# EAGLE design HexBoard (EAGLE 7.1.0)
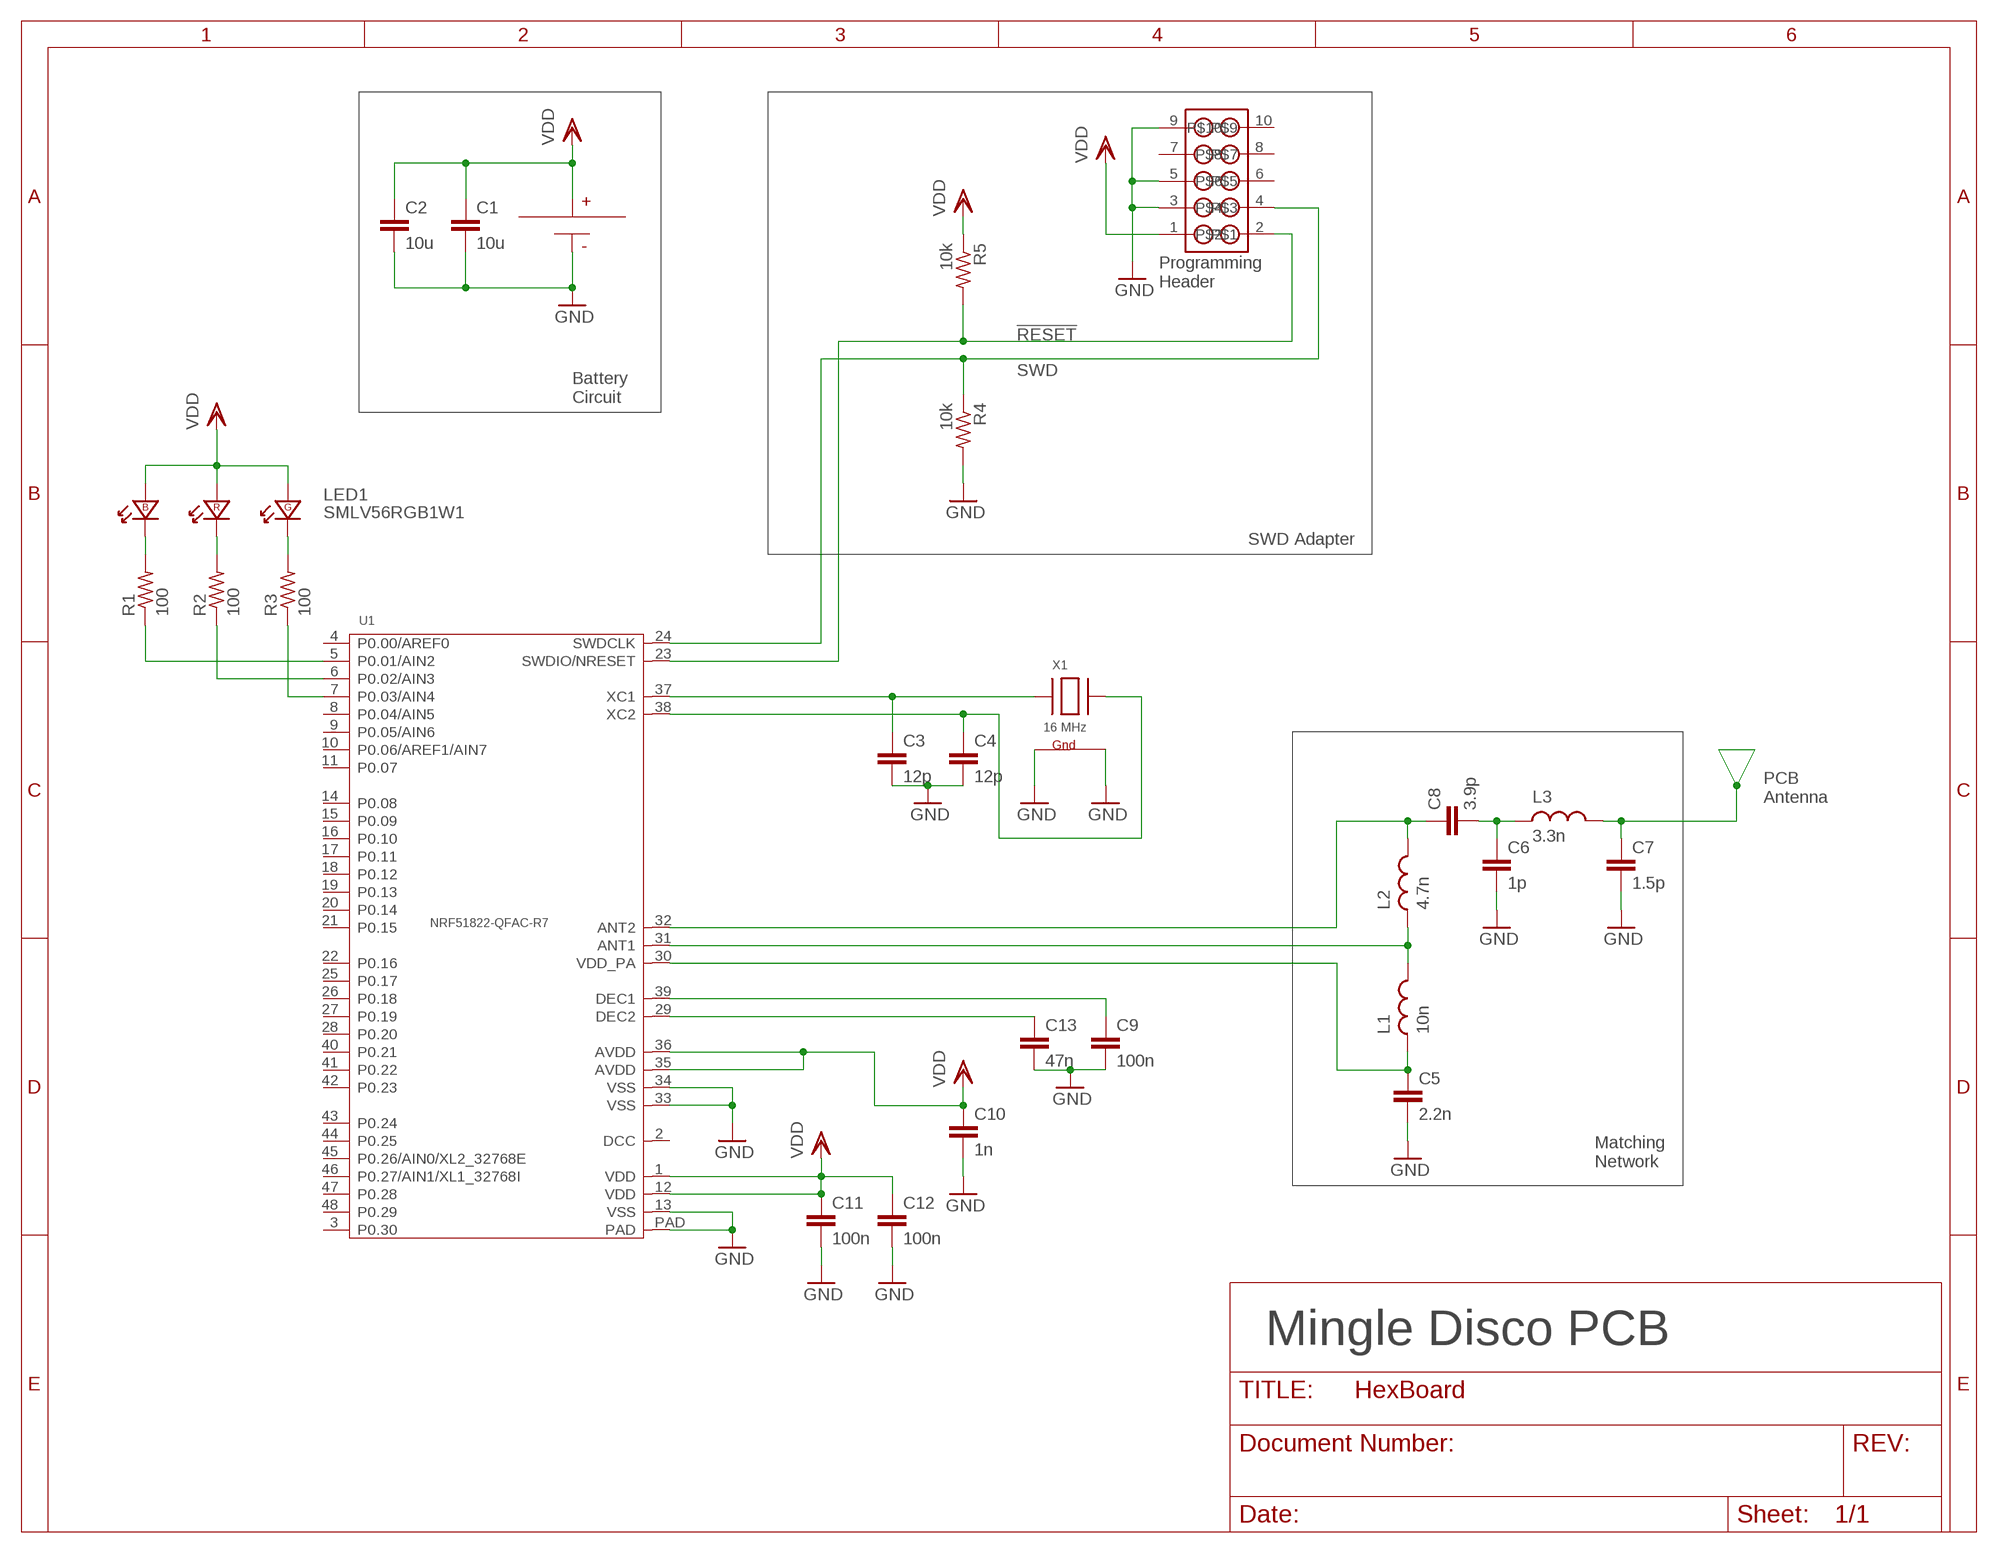
[diagram p0: schematic, sheet 1]

## Parts
B1  CON-COINCEL-HOLDER-KEYSTONE-3012TR  [16MM-COINCELL-KEYSTONE]
C1  10u  C-EUC0805  [C0805]
C2  10u  C-EUC0805  [C0805]
C3  12p  C-EUC0402  [C0402]
C4  12p  C-EUC0402  [C0402]
C5  2.2n  C-EUC0402  [C0402]
C6  1p  C-EUC0402  [C0402]
C7  1.5p  C-EUC0402  [C0402]
C8  3.9p  C-EUC0402  [C0402]
C9  100n  C-EUC0402  [C0402]
C10  1n  C-EUC0402  [C0402]
C11  100n  C-EUC0402  [C0402]
C12  100n  C-EUC0402  [C0402]
C13  47n  C-EUC0402  [C0402]
L1  10n  L-US0402-B-NOSILK  [.0402-B-NOSILK]
L2  4.7n  L-US0402-B-NOSILK  [.0402-B-NOSILK]
L3  3.3n  L-US0402-B-NOSILK  [.0402-B-NOSILK]
LED1  SMLV56RGB1W1  LED-RGB-SEPARATE-3528  [LED-3528]
R1  100  R-US_R0402  [R0402]
R2  100  R-US_R0402  [R0402]
R3  100  R-US_R0402  [R0402]
R4  10k  R-US_R0402  [R0402]
R5  10k  R-US_R0402  [R0402]
U1  NRF51822-QFAC-R7  NRF51822  [QFN48-6X6MM]
U$1  HEADER.05"PITCH  [HEADER.05"PITCH]
X1  16 MHz  TXC-CRYSTAL  [TXC_CRYSTAL]

## Nets
!RESET: R5.2 U1.23(SWDIO/NRESET) U$1.2
ANTENNA: C7.1 L3.2
GND: B1.NEG C1.2 C2.2 C3.2 C4.2 C5.2 C6.2 C7.2 C9.2 C10.2 C11.2 C12.2 C13.2 R4.2 U1.13(VSS) U1.33(VSS) U1.34(VSS) U1.PAD U$1.3 U$1.5 U$1.9 X1.2(G1) X1.4(G2)
N$1: LED1.6(B:K) R1.2
N$2: LED1.5(R:K) R2.2
N$3: LED1.4(G:K) R3.2
N$4: R1.1 U1.5(P0.01/AIN2)
N$5: R2.1 U1.6(P0.02/AIN3)
N$6: R3.1 U1.7(P0.03/AIN4)
N$8: C3.1 U1.37(XC1) X1.1(X1)
N$9: C4.1 U1.38(XC2) X1.3(X2)
N$11: L1.2 L2.1 U1.31(ANT1)
N$12: C9.1 U1.39(DEC1)
N$13: C6.1 C8.2 L3.1
N$15: C8.1 L2.2 U1.32(ANT2)
N$17: C5.1 L1.1 U1.30(VDD_PA)
N$18: C13.1 U1.29(DEC2)
SWD: R4.1 U1.24(SWDCLK) U$1.4
VDD: B1.POS@1(POS) B1.POS@2(POS) C1.1 C2.1 C10.1 C11.1 C12.1 LED1.1(B:A) LED1.2(R:A) LED1.3(G:A) R5.1 U1.1(VDD) U1.12(VDD) U1.35(AVDD) U1.36(AVDD) U$1.1
Unconnected: U1.2(DCC) U1.3(P0.30) U1.4(P0.00/AREF0) U1.8(P0.04/AIN5) U1.9(P0.05/AIN6) U1.10(P0.06/AREF1/AIN7) U1.11(P0.07) U1.14(P0.08) U1.15(P0.09) U1.16(P0.10) U1.17(P0.11) U1.18(P0.12) U1.19(P0.13) U1.20(P0.14) U1.21(P0.15) U1.22(P0.16) U1.25(P0.17) U1.26(P0.18) U1.27(P0.19) U1.28(P0.20) U1.40(P0.21) U1.41(P0.22) U1.42(P0.23) U1.43(P0.24) U1.44(P0.25) U1.45(P0.26/AIN0/XL2_32768E) U1.46(P0.27/AIN1/XL1_32768I) U1.47(P0.28) U1.48(P0.29) U$1.6 U$1.7 U$1.8 U$1.10

## Notes on the sheet
- Programming
  Header
- Battery
  Circuit
- SWD Adapter
- PCB
  Antenna
- Matching
  Network
- Mingle Disco PCB

## Library data of the parts
B1 = 16mm-coincell-keystone:CON-COINCEL-HOLDER-KEYSTONE-3012TR
C1-C13 = rcl:C-EU: CAPACITOR, European symbol
L1-L3 = rcl_custom:L-US: INDUCTOR, American symbol
LED1 = rgb-led-separate:LED-RGB-SEPARATE-*: RGB LED with separate contacts for all 3 chips
R1-R5 = adafruit:R-US_: RESISTOR, American symbol
U1 = nrf51822:NRF51822: Multi-protocol Blutooth 4.0 low energy /2. GHz RF SoC
U$1 = Headers:HEADER.05"PITCH
X1 = TXC:TXC-CRYSTAL: 4-SMD Crystal 2.5mm x 2.0mm

## Net classes
0 default: width 0.102 mm, drill 0.203 mm, clearance 0.102 mm

## Board
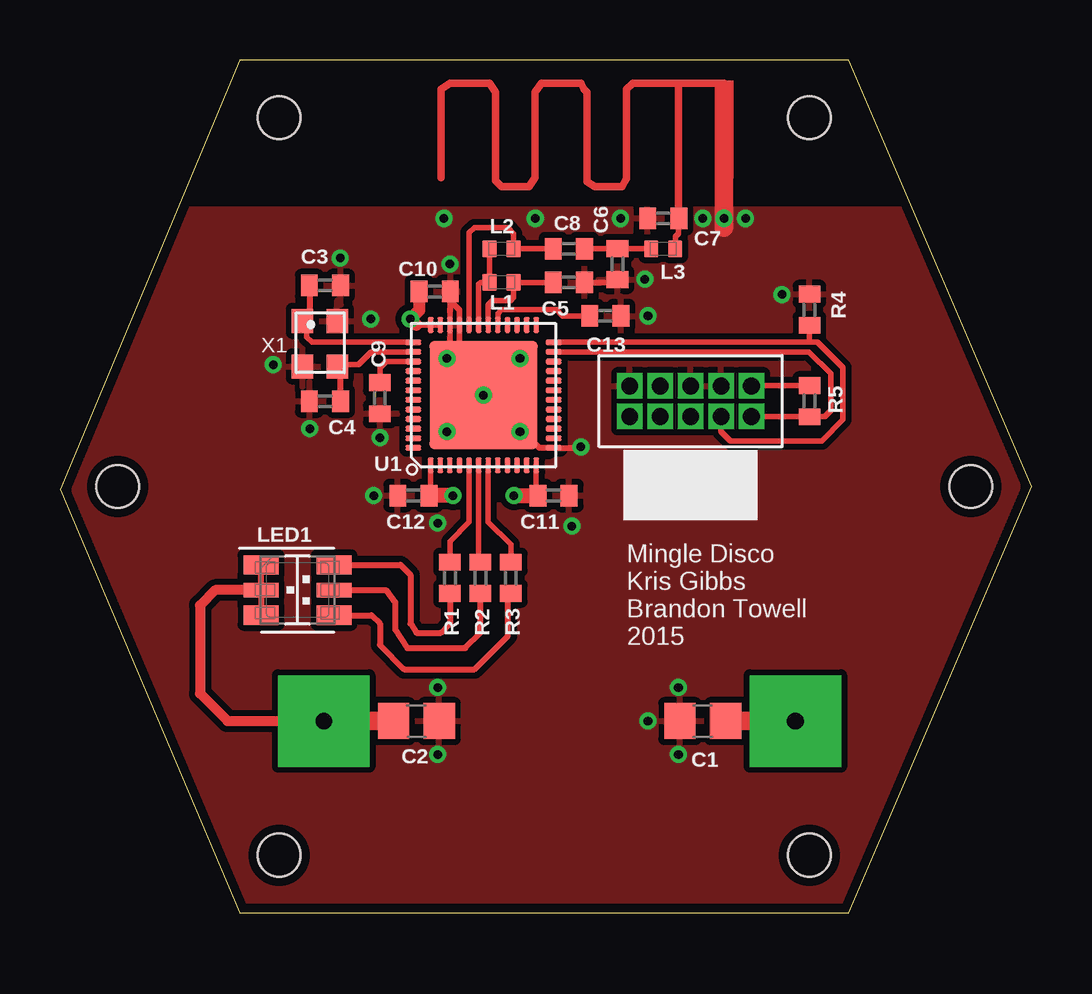
[diagram p1: board, top side]
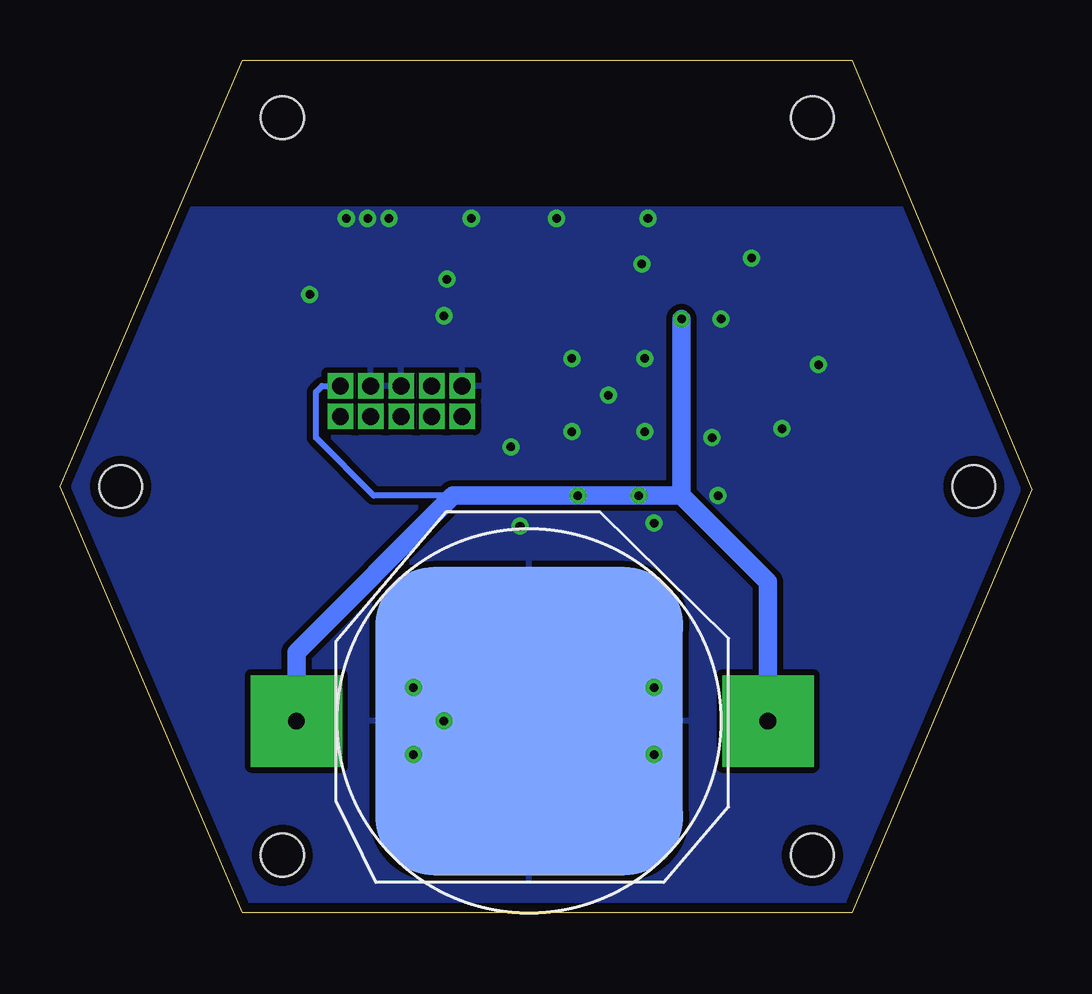
[diagram p2: board, bottom side, seen from below]

Size 40.51 x 35.56 mm. Coordinates in mm from the lower left corner, seen from the top.
Outline: 0,17.65 7.49,0 32.89,0 40.51,17.78 32.89,35.56 7.49,35.56 0,17.65
Copper layers (1*16): Top 0.0356mm / dielectric 1.5011mm / Bottom 0.0356mm
Design rules "LaenPCBOrder": minimum track width 6mil, minimum drill 13mil, track to track 6mil, track to pad 6mil, pad to pad 6mil, via to via 6mil, smd to smd 6mil, copper to edge 15mil, drill to drill 6mil, minimum pad ring 7mil, minimum via ring 7mil, stop-mask expansion 3mil, vias tented up to drill 0mil, thermal gap 10mil
Holes 1.78 mm at 9.14,2.41 31.24,2.41 31.24,33.15 9.14,33.15 2.41,17.78 37.97,17.78
tRestrict: 5 lines

### Footprints (pad centres in the part's own frame; a part is rotated, then mirrored left to right if it is on the bottom)
16MM-COINCELL-KEYSTONE = smd 12.842 x 12.842: NEG 0.762,0 | drill 0.7 pad 3.81 square: POS@1 -9.195,0; POS@2 10.465,0
C0805 = smd 1.3 x 1.5: 1 -0.95,0; 2 0.95,0
C0402 = smd 0.7 x 0.9: 1 -0.65,0; 2 0.65,0
.0402-B-NOSILK = smd 0.6 x 0.7: 1 -0.5,0; 2 0.5,0
LED-3528 = smd 1.45 x 0.8: 1 -1.525,1.05; 3 -1.525,-1.05; 4 1.525,-1.05; 6 1.525,1.05 | smd 1.45 x 0.6: 2 -1.525,0; 5 1.525,0
R0402 = smd 0.7 x 0.9: 1 -0.65,0; 2 0.65,0
QFN48-6X6MM = smd 0.23 x 0.65: 1 -2.2,-2.925; 2 -1.8,-2.925; 3 -1.4,-2.925; 4 -1,-2.925; 5 -0.6,-2.925; 6 -0.2,-2.925; 7 0.2,-2.925; 8 0.6,-2.925; 9 1,-2.925; 10 1.4,-2.925; 11 1.8,-2.925; 12 2.2,-2.925; 25 2.2,2.925; 26 1.8,2.925; 27 1.4,2.925; 28 1,2.925; 29 0.6,2.925; 30 0.2,2.925; 31 -0.2,2.925; 32 -0.6,2.925; 33 -1,2.925; 34 -1.4,2.925; 35 -1.8,2.925; 36 -2.2,2.925 | smd 0.65 x 0.23: 13 2.925,-2.2; 14 2.925,-1.8; 15 2.925,-1.4; 16 2.925,-1; 17 2.925,-0.6; 18 2.925,-0.2; 19 2.925,0.2; 20 2.925,0.6; 21 2.925,1; 22 2.925,1.4; 23 2.925,1.8; 24 2.925,2.2; 37 -2.925,2.2; 38 -2.925,1.8; 39 -2.925,1.4; 40 -2.925,1; 41 -2.925,0.6; 42 -2.925,0.2; 43 -2.925,-0.2; 44 -2.925,-0.6; 45 -2.925,-1; 46 -2.925,-1.4; 47 -2.925,-1.8; 48 -2.925,-2.2 | smd 4.5 x 4.5: PAD 0,0
HEADER.05"PITCH = drill 0.7 pad 1.016 square: 1 -1.27,0; 2 -1.27,1.27; 3 0,0; 4 0,1.27; 5 1.27,0; 6 1.27,1.27; 7 2.54,0; 8 2.54,1.27; 9 3.81,0; 10 3.81,1.27
TXC_CRYSTAL = smd 1 x 0.9: 1 -0.93,-0.558; 2 0.97,-0.558; 3 0.97,0.892; 4 -0.93,0.892

### Placement (x,y rotation side)
B1  20.19,8 180 bottom
C1  26.8,8 180 top
C2  14.86,8 0 top
C3  11.05,26.16 0 top
C4  11.05,21.34 180 top
C5  21.21,26.29 0 top
C6  23.24,27.05 270 top
C7  25.15,28.96 180 top
C8  21.21,27.69 0 top
C9  13.33,21.46 270 top
C10  15.62,25.91 0 top
C11  20.57,17.4 0 top
C12  14.73,17.4 180 top
C13  22.73,24.89 0 top
L1  18.42,26.29 180 top
L2  18.42,27.69 0 top
L3  25.15,27.69 0 top
LED1  9.91,13.46 0 top
R1  16.26,13.97 270 top
R2  17.53,13.97 270 top
R3  18.8,13.97 270 top
R4  31.24,25.15 90 top
R5  31.24,21.34 270 top
U1  17.65,21.59 0 top
U$1  27.56,21.97 180 top
X1  10.67,23.75 270 top

### Tracks (layer width: path | path; a pad name or v marks a point on that pad's centre or on a via)
!RESET
  Top 0.229: U$1.2 28.84,20.69 R5.2 31.26,20.7 31.88,20.7 32.13,20.95 32.13,22.48 31.22,23.39 U1.23
ANTENNA
  Top 0.229: L3.2 25.65,28.19 25.78,28.32 25.78,28.94 C7.1
  Top 0.305: 25.78,34.59 25.78,28.97 C7.1 | 25.78,34.59 23.88,34.59 23.62,34.34 23.62,30.61 23.42,30.28 22.3,30.28 21.97,30.48 21.97,34.21 21.84,34.34 21.72,34.59 20.07,34.59 19.81,34.21 19.81,30.66 19.56,30.28 18.42,30.28 18.16,30.53 18.16,34.21 17.91,34.59 16.26,34.59 15.87,34.34 15.87,30.66 | 25.78,34.59 27.69,34.59
GND  (via drill 0.36)
  Top 0.229: 16.65,23.5 U1.33 16.65,25.13 16.38,25.4 16.38,25.91 16.25,25.78 U1.34 16.25,23.39 | U1.13 21.68,19.39 v21.72,19.43 | C5.2 23,26.29 C6.2
  Top 0.254: U1.13 19.98,19.39 18.92,20.45 | v16.13,20.07 U1.PAD
  Top 0.406: 18.92,20.45 18.8,20.45 U1.PAD 16.89,22.35 16.89,22.73 16.65,22.97 16.65,23.5
  Top 0.762: 27.69,31.11 27.69,28.57
  other vias: 16.13,23.11 19.18,23.11 19.18,20.07 17.65,21.59 27.69,28.96 26.8,28.96 28.58,28.96 24.38,26.42 24.51,24.89 23.37,28.96 19.81,28.96 16,28.96 16.26,27.05 12.95,24.77 11.68,27.3 8.89,22.86 10.41,20.19 13.33,19.81 13.08,17.4 15.75,16.26 21.34,16.13 30.1,25.78 25.78,9.4 24.51,8 25.78,6.6 15.75,6.6 15.75,9.4
  pour Bottom (isolate 0.254): -0.13,17.78 7.49,0 32.89,0 40.51,17.78 35.43,29.34 4.95,29.34
  pour Top (isolate 0.254): -0.13,17.78 4.95,29.34 35.43,29.34 40.51,17.78 32.89,0 7.49,0
N$1
  Top 0.254: R1.2 16.26,12.06 15.87,11.68 14.86,11.68 14.6,12.06 14.6,14.1 14.19,14.51 LED1.6
N$2
  Top 0.254: LED1.5 13.59,13.46 13.97,12.95 13.97,11.81 14.48,11.05 16.89,11.05 17.53,11.68 R2.2
N$3
  Top 0.254: 18.81,13.34 R3.2 18.67,13.19 18.67,11.56 17.27,10.16 14.35,10.16 13.33,11.18 13.33,12.06 12.99,12.41 LED1.4
N$4
  Top 0.229: U1.5 17.05,16.29 16.26,15.49 R1.1
N$5
  Top 0.229: U1.6 17.45,14.69
  Top 0.254: 17.45,14.69 R2.1
N$6
  Top 0.229: U1.7 17.85,16.31 18.8,15.37 R3.1
N$8
  Top 0.229: U1.37 10.5,23.79 10.29,24 10.29,24.72
  Top 0.254: C3.1 10.4,24.75 | 10.4,24.75 10.29,24.64 10.29,24.72 | X1.1 10.22,24.93 10.4,24.75
N$9
  Top 0.229: U1.38 12.98,23.39 12.45,22.86 11.39,22.86
  Top 0.254: C4.1 11.7,22.89 11.67,22.89 X1.3 11.48,22.86 11.39,22.86 11.39,22.87
N$11
  Top 0.229: U1.31 17.45,26.22 17.53,26.29 L1.2 L2.1
N$12
  Top 0.229: U1.39 13.59,22.99 13.33,22.73 C9.1
N$13
  Top 0.229: C8.2 23.1,27.69 C6.1 23.26,27.69 L3.1
N$15
  Top 0.229: U1.32 17.05,28.36 17.27,28.57 18.67,28.57 18.92,28.33 L2.2 C8.1
N$17
  Top 0.229: U1.30 17.85,25.35 18.03,25.53 18.8,25.53 18.92,25.65 L1.1 C5.1 20.8,26.27
N$18
  Top 0.229: U1.29 18.25,24.98 18.42,25.15 20.7,25.15 20.96,24.89 C13.1
SWD
  Top 0.229: U$1.4 27.56,20.07 27.94,19.68 31.75,19.68 32.64,20.57 32.64,22.73 31.58,23.79 31.24,23.79 | U1.24 31.24,23.79 | R4.1 31.24,23.79
VDD  (via drill 0.36)
  Top 0.229: U1.1 15.45,17.6 | U1.35 U1.36 14.85,24.52 | U1.12 19.85,17.47 C11.1 | R5.1 28.84,21.99 U$1.1
  Top 0.254: 15.45,17.6 C12.1 | LED1.3 LED1.2 LED1.1
  Top 0.406: LED1.2 6.48,13.46 5.84,12.83 5.84,9.14 6.99,8 B1.POS@1
  Top 0.508: 15.37,17.51 C12.1 | 14.85,24.52 v14.6,24.77 14.97,25.13 C10.1
  Top 0.635: v16.38,17.4 C12.1 | v18.92,17.4 C11.1
  Top 0.762: C2.1 B1.POS@1 | C1.1 B1.POS@2
  Bottom 0.254: 24.13,17.4 27.43,17.4 29.85,19.81 29.85,21.72 29.59,21.97 U$1.1
  Bottom 0.762: v16.38,17.4 v18.92,17.4 | 17.14,17.4 v16.38,17.4 | 22.48,17.4 v18.92,17.4 | v18.92,17.4 24.13,17.4 30.66,10.87 B1.POS@2 | B1.POS@1 11,13.79 14.6,17.4 | v16.38,17.4 14.6,17.4 | v14.6,24.77 14.6,17.4
(copper drawn outside any net)
  shapes: Top area x1

### Text on the board
tNames: Mingle Disco / Kris Gibbs / Brandon Towell / 2015